# EAGLE design RFNODE (EAGLE 6.5.0)
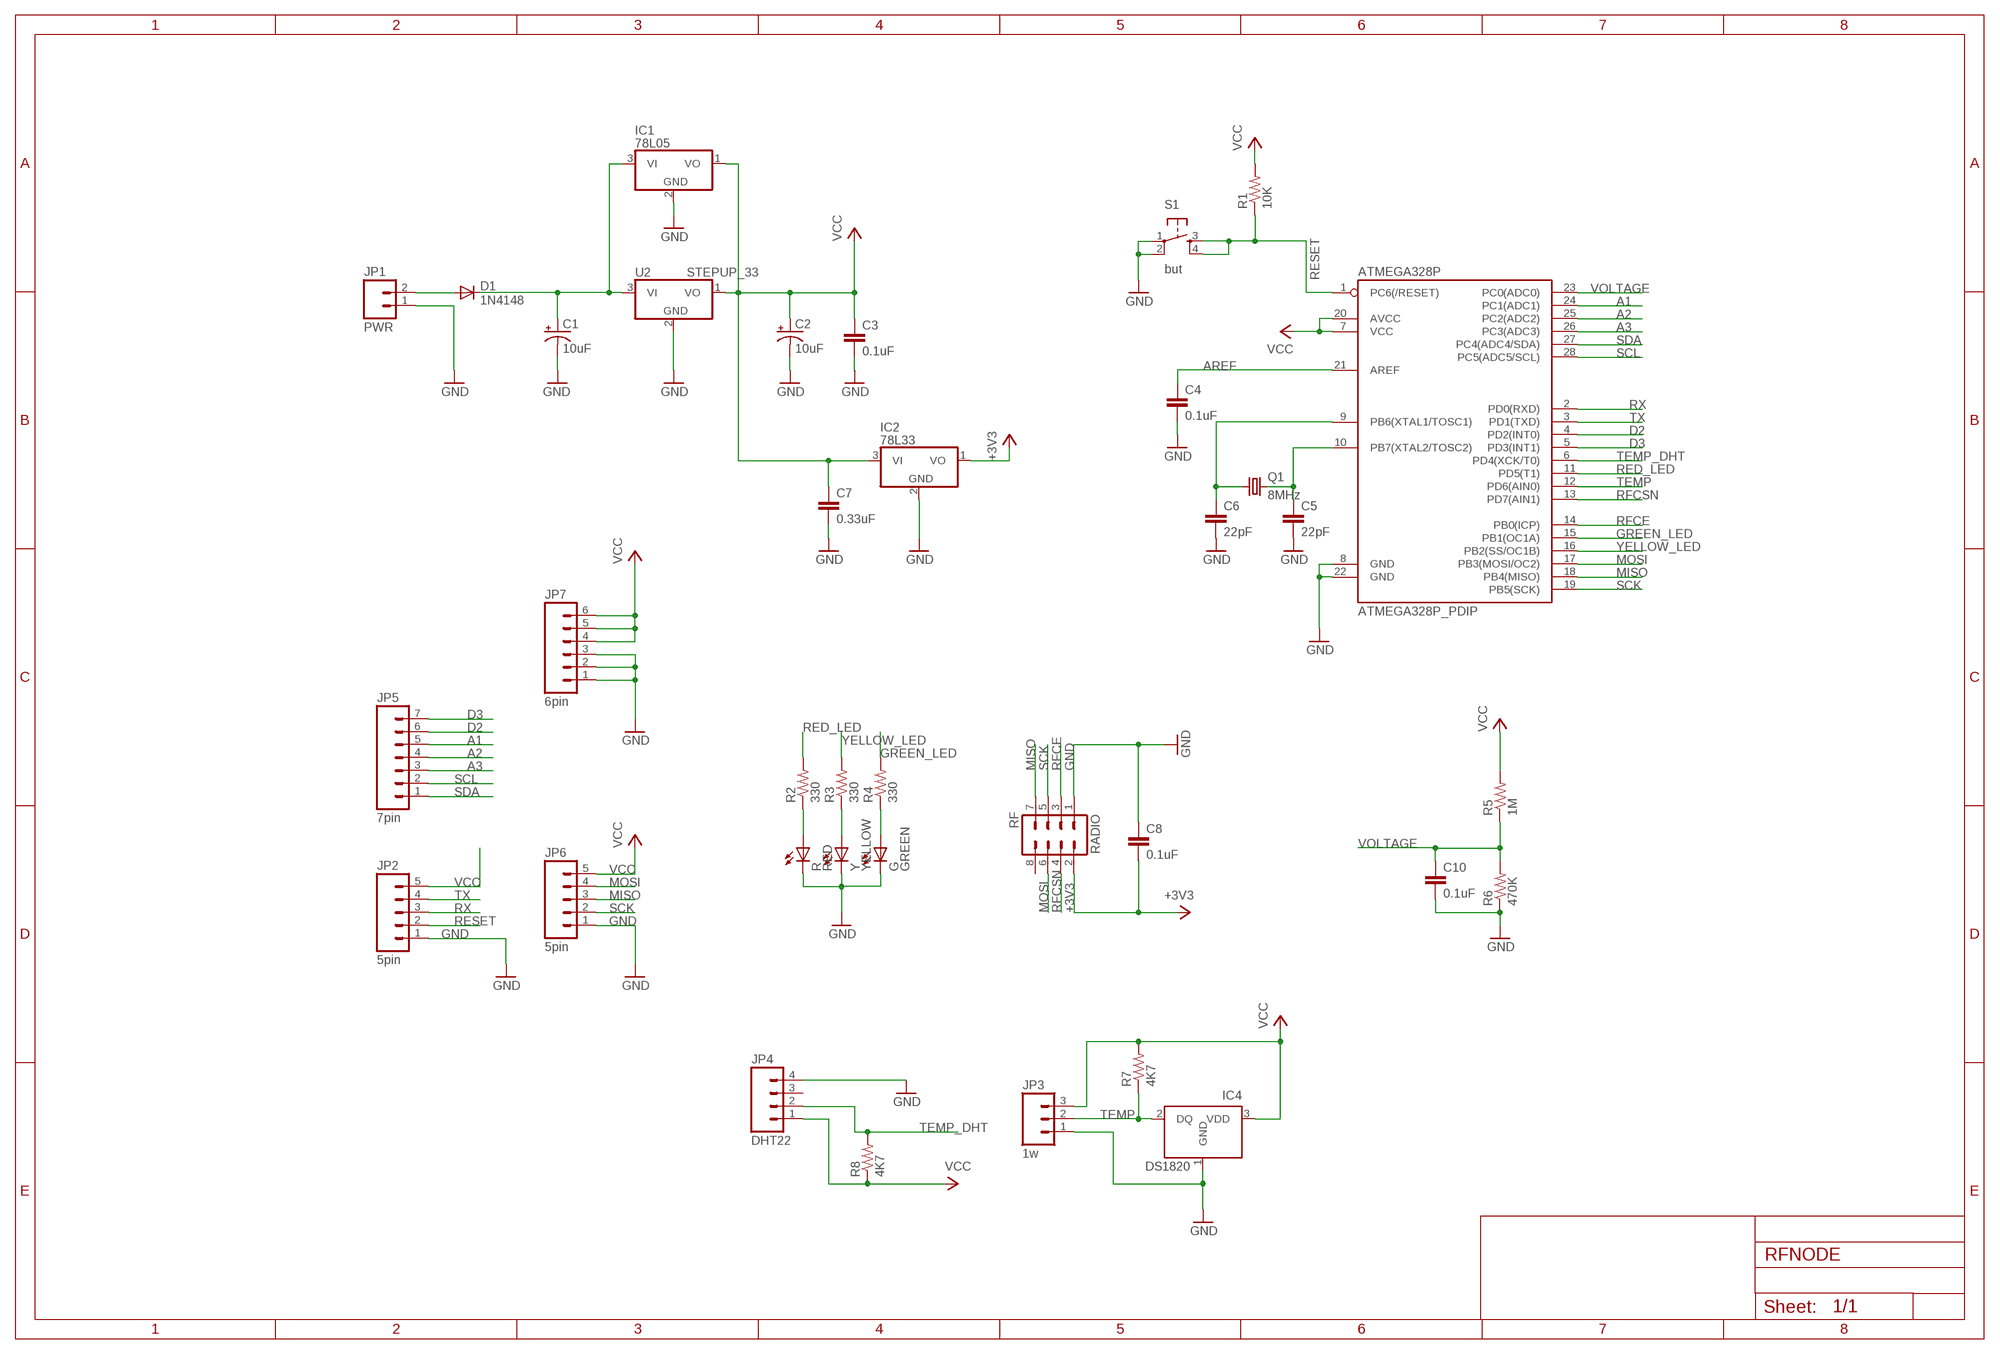
[diagram p0: schematic, sheet 1]

## Parts
ATMEGA328P  ATMEGA328P_PDIP  [DIL28-3]
C1  10uF  CPOL-USE2-4  [E2-4]
C2  10uF  CPOL-USE2-4  [E2-4]
C3  0.1uF  C-EUC1206  [C1206]
C4  0.1uF  C-EUC1206  [C1206]
C5  22pF  C-EUC1206  [C1206]
C6  22pF  C-EUC1206  [C1206]
C7  0.33uF  C-EUC1206  [C1206]
C8  0.1uF  C-EUC1206  [C1206]
C10  0.1uF  C-EUC1206  [C1206]
D1  1N4148  DIODE-D-2.5  [D-2.5]
G  GREEN  LED3MM  [LED3MM]
IC1  78L05  78L05Z  [TO92]
IC2  78L33  78L05Z  [TO92]
IC4  DS1820  [TO-92]
JP1  PWR  M02POLAR  [MOLEX-1X2]
JP2  5pin  M05PTH  [1X05]
JP3  1w  M03PTH  [1X03]
JP4  DHT22  M04PTH  [1X04]
JP5  7pin  M07  [1X07]
JP6  5pin  M05PTH  [1X05]
JP7  6pin  M06SIP  [1X06]
Q1  8MHz  CRYSTALHC49S  [HC49/S]
R  RED  LED3MM  [LED3MM]
R1  10K  R-US_R1206  [R1206]
R2  330  R-US_R1206  [R1206]
R3  330  R-US_R1206  [R1206]
R4  330  R-US_R1206  [R1206]
R5  1M  R-US_R1206  [R1206]
R6  470K  R-US_R1206  [R1206]
R7  4K7  R-US_R1206  [R1206]
R8  4K7  R-US_R1206  [R1206]
RADIO  RF  M04X2  [2X4]
S1  but  TAC_SWITCHPTH  [TACTILE-PTH]
U2  STEPUP_33  DC-DC_STEPUP  [1X03]
Y  YELLOW  LED3MM  [LED3MM]

## Nets
+3V3: C8.2 IC2.1(VO) RADIO.2
A1: ATMEGA328P.24(PC1(ADC1)) JP5.5
A2: ATMEGA328P.25(PC2(ADC2)) JP5.4
A3: ATMEGA328P.26(PC3(ADC3)) JP5.3
AREF: ATMEGA328P.21(AREF) C4.1
D2: ATMEGA328P.4(PD2(INT0)) JP5.6
D3: ATMEGA328P.5(PD3(INT1)) JP5.7
GND: ATMEGA328P.8(GND) ATMEGA328P.22(GND) C1.- C2.- C3.2 C4.2 C5.2 C6.2 C7.2 C8.1 C10.2 G.K(C) IC1.2(GND) IC2.2(GND) IC4.1(GND) JP1.1 JP2.1 JP3.1 JP4.4 JP6.1 JP7.1 JP7.2 JP7.3 R6.1 R.K(C) RADIO.1 S1.1 S1.2 U2.2(GND) Y.K(C)
GREEN_LED: ATMEGA328P.15(PB1(OC1A)) R4.2
MISO: ATMEGA328P.18(PB4(MISO)) JP6.4 RADIO.7
MOSI: ATMEGA328P.17(PB3(MOSI/OC2)) JP6.3 RADIO.6
N$6: R2.1 R.A
N$7: R3.1 Y.A
N$8: G.A R4.1
RAW: D1.A JP1.2
RAW_PROT: C1.+ D1.C IC1.3(VI) U2.3(VI)
RED_LED: ATMEGA328P.11(PD5(T1)) R2.2
RESET: ATMEGA328P.1(PC6(/RESET)) JP2.2 R1.1 S1.3 S1.4
RFCE: ATMEGA328P.14(PB0(ICP)) RADIO.3
RFCSN: ATMEGA328P.13(PD7(AIN1)) RADIO.4
RX: ATMEGA328P.2(PD0(RXD)) JP2.3
SCK: ATMEGA328P.19(PB5(SCK)) JP6.2 RADIO.5
SCL: ATMEGA328P.28(PC5(ADC5/SCL)) JP5.1
SDA: ATMEGA328P.27(PC4(ADC4/SDA)) JP5.2
TEMP: ATMEGA328P.12(PD6(AIN0)) IC4.2(DQ) JP3.2 R7.1
TEMP_DHT: ATMEGA328P.6(PD4(XCK/T0)) JP4.2 R8.2
TX: ATMEGA328P.3(PD1(TXD)) JP2.4
VCC: ATMEGA328P.7(VCC) ATMEGA328P.20(AVCC) C2.+ C3.1 C7.1 IC1.1(VO) IC2.3(VI) IC4.3(VDD) JP2.5 JP3.3 JP4.1 JP6.5 JP7.4 JP7.5 JP7.6 R1.2 R5.2 R7.2 R8.1 U2.1(VO)
VOLTAGE: ATMEGA328P.23(PC0(ADC0)) C10.1 R5.1 R6.2
XTAL1: ATMEGA328P.9(PB6(XTAL1/TOSC1)) C6.1 Q1.1
XTAL2: ATMEGA328P.10(PB7(XTAL2/TOSC2)) C5.1 Q1.2
YELLOW_LED: ATMEGA328P.16(PB2(SS/OC1B)) R3.2
Unconnected: JP4.3 RADIO.8

## Library data of the parts
ATMEGA328P = SparkFun-DigitalIC:ATMEGA328P_PDIP: uC used in the Arduino 32kb flash, 1k EEPROM, 2k SRAM This is the through-hole version of this chip.
C1 C2 = rcl:CPOL-US: POLARIZED CAPACITOR, American symbol
C3-C8 C10 = rcl:C-EU: CAPACITOR, European symbol
D1 = diode:DIODE-: DIODE
G R Y = SparkFun-LED:LED: LEDs Standard schematic elements and footprints for 5mm, 3mm, 1206, and 0603 sized LEDs. 5mm - Spark Fun Electronics SKU : COM-00529 (and others)
IC1 IC2 = adafruit:78*: Positive VOLTAGE REGULATOR Added bigger pads to the TO-92 package
IC4 = DS1820:DS1820: DS1820 - 1-Wire Digital Thermometer
JP1 = SparkFun-Connectors:M02: Standard 2-pin 0.1" header. Use with - straight break away headers ( PRT-00116) - right angle break away headers (PRT-00553) - swiss pins (PRT-00743) - machine pins (PRT-00117) - female headers (PRT-00115) Molex polarized connector foot print use with: PRT-08233 with associated crimp pins and housings. 2.54_SCREWTERM for use with PRT-10571. 3.5mm Screw Terminal footprints for PRT-08084 5mm Screw Terminal footprints for use with PRT-08433
JP2 JP6 = SparkFun-Connectors:M05: Header 5 Standard 5-pin 0.1" header. Use with straight break away headers (SKU : PRT-00116), right angle break away headers (PRT-00553), swiss pins (PRT-00743), machine pins (PRT-00117), and female headers (PRT-00115). Molex polarized connector foot print use with SKU : PRT-08230 with associated crimp pins and housings.
JP3 = SparkFun-Connectors:M03: Header 3 Standard 3-pin 0.1" header. Use with straight break away headers (SKU : PRT-00116), right angle break away headers (PRT-00553), swiss pins (PRT-00743), machine pins (PRT-00117), and female headers (PRT-00115). Molex polarized connector foot print use with SKU : PRT-08232 with associated crimp pins and housings.
JP4 = SparkFun-Connectors:M04: Header 4 Standard 4-pin 0.1" header. Use with straight break away headers (SKU : PRT-00116), right angle break away headers (PRT-00553), swiss pins (PRT-00743), machine pins (PRT-00117), and female headers (PRT-00115). Molex polarized connector foot print use with SKU : PRT-08231 with associated crimp pins and housings. 1MM SMD Version SKU: PRT-10208
JP5 = SparkFun-Connectors:M07: Header 7 Standard 7-pin 0.1" header. Use with straight break away headers (SKU : PRT-00116), right angle break away headers (PRT-00553), swiss pins (PRT-00743), machine pins (PRT-00117), and female headers (PRT-00115). NOTES ON THE VARIANTS LOCK and LOCK_LONGPADS... This footprint was designed to help hold the alignment of a through-hole component (i.e. 7-pin header) while soldering it into place. You may notice that each hole has been shifted either up or down by 0.005 of an inch from it's more standard position (which is usually a perfectly straight line). This slight alteration caused the pins (the squares in the middle) to touch the edges of the holes. Because they are alternating, it causes a "brace" to hold the header in place. 0.005 has proven to be the perfect amount of "off-center" position when using our standard breakaway headers. Although looks a little odd when you look at the bare footprint, once you have a header in there, the alteration is very hard to notice. Also, if you push a header all the way into place, it is covered up entirely on the bottom side. This idea of altering the position of holes to aid alignment will be further integrated into the Sparkfun Library for other footprints. It can help hold any component with 3 or more connection pins.
JP7 = SparkFun-Connectors:M06: Header 6 Standard 6-pin 0.1" header. Use with straight break away headers (SKU : PRT-00116), right angle break away headers (PRT-00553), swiss pins (PRT-00743), machine pins (PRT-00117), and female headers (PRT-00115). Molex polarized connector foot print use with SKU : PRT-08094 with associated crimp pins and housings. NOTES ON THE VARIANTS LOCK and LOCK_LONGPADS... This footprint was designed to help hold the alignment of a through-hole component (i.e. 6-pin header) while soldering it into place. You may notice that each hole has been shifted either up or down by 0.005 of an inch from it's more standard position (which is a perfectly straight line). This slight alteration caused the pins (the squares in the middle) to touch the edges of the holes. Because they are alternating, it causes a "brace" to hold the component in place. 0.005 has proven to be the perfect amount of "off-center" position when using our standard breakaway headers. Although looks a little odd when you look at the bare footprint, once you have a header in there, the alteration is very hard to notice. Also,if you push a header all the way into place, it is covered up entirely on the bottom side. This idea of altering the position of holes to aid alignment will be further integrated into the Sparkfun Library for other footprints. It can help hold any component with 3 or more connection pins.
Q1 = crystal:CRYSTAL: CRYSTAL; OC_FARNELL: 1667008; OC_NEWARK: unknown
R1-R8 = rcl:R-US_: RESISTOR, American symbol
RADIO = SparkFun-Connectors:M04X2: .1" header, two rows of four.
S1 = SparkFun-Electromechanical:TAC_SWITCH: Momentary Switch Button commonly used for reset or general input. Spark Fun Electronics SKU : COM-00097 SMT- SWCH-08247
U2 = az:DC-DC_STEPUP: DC-DC

## Board
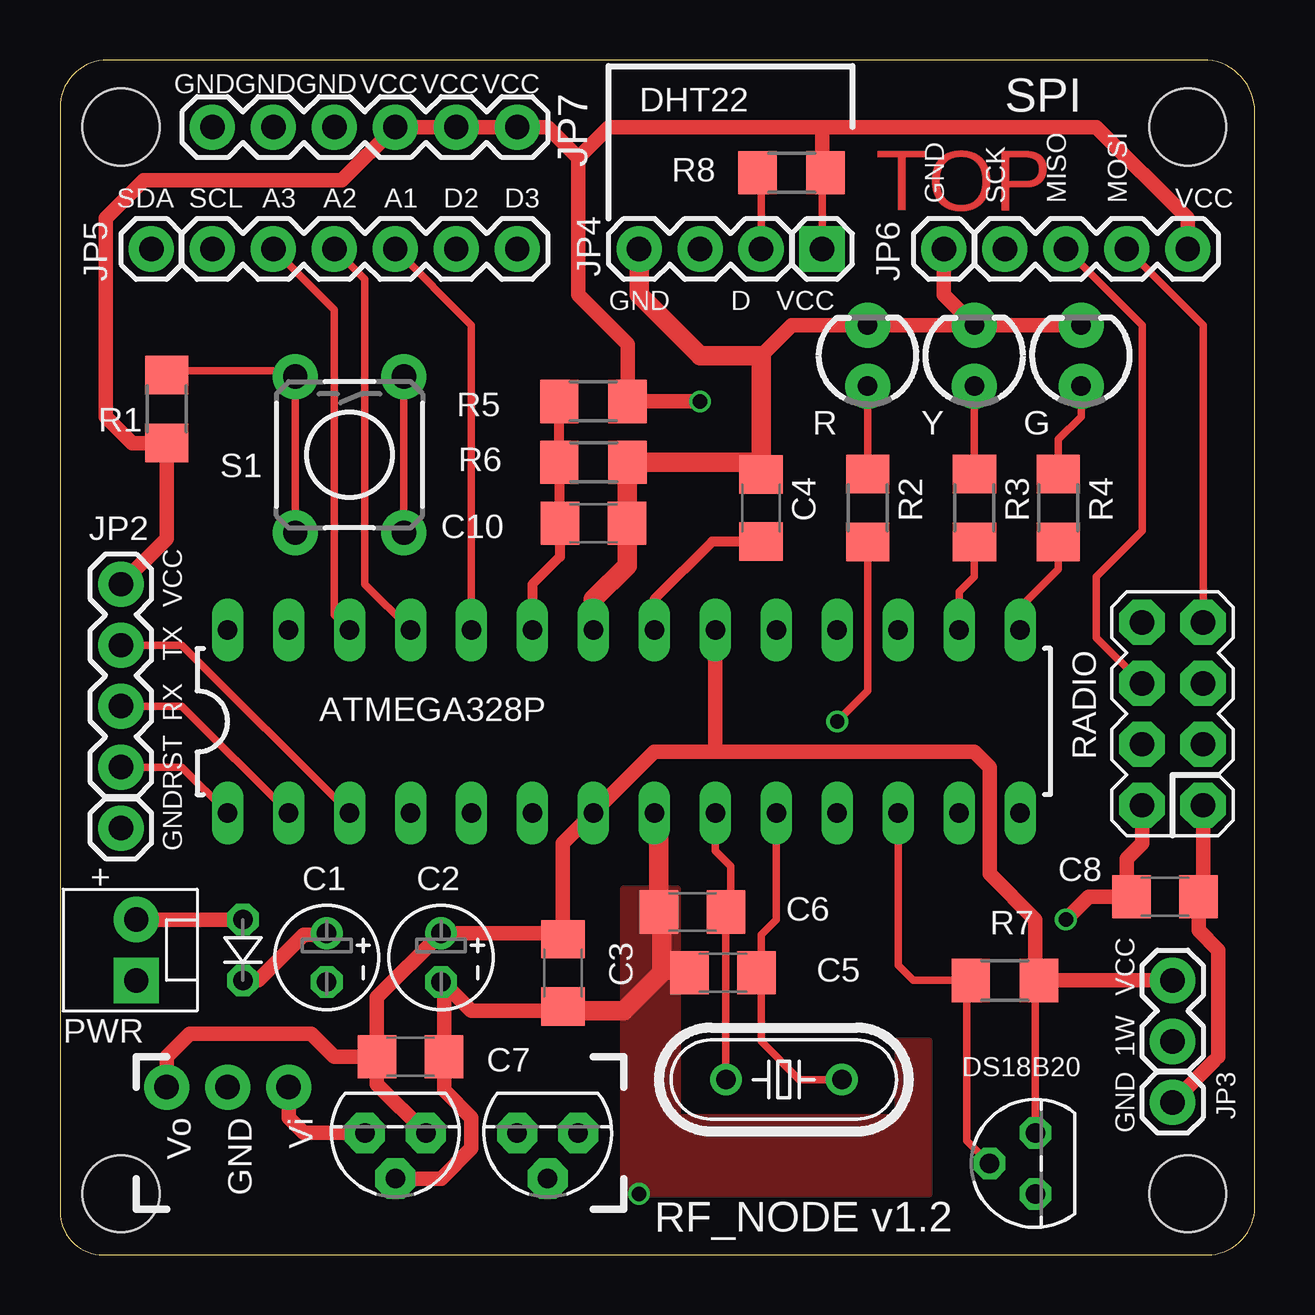
[diagram p1: board, top side]
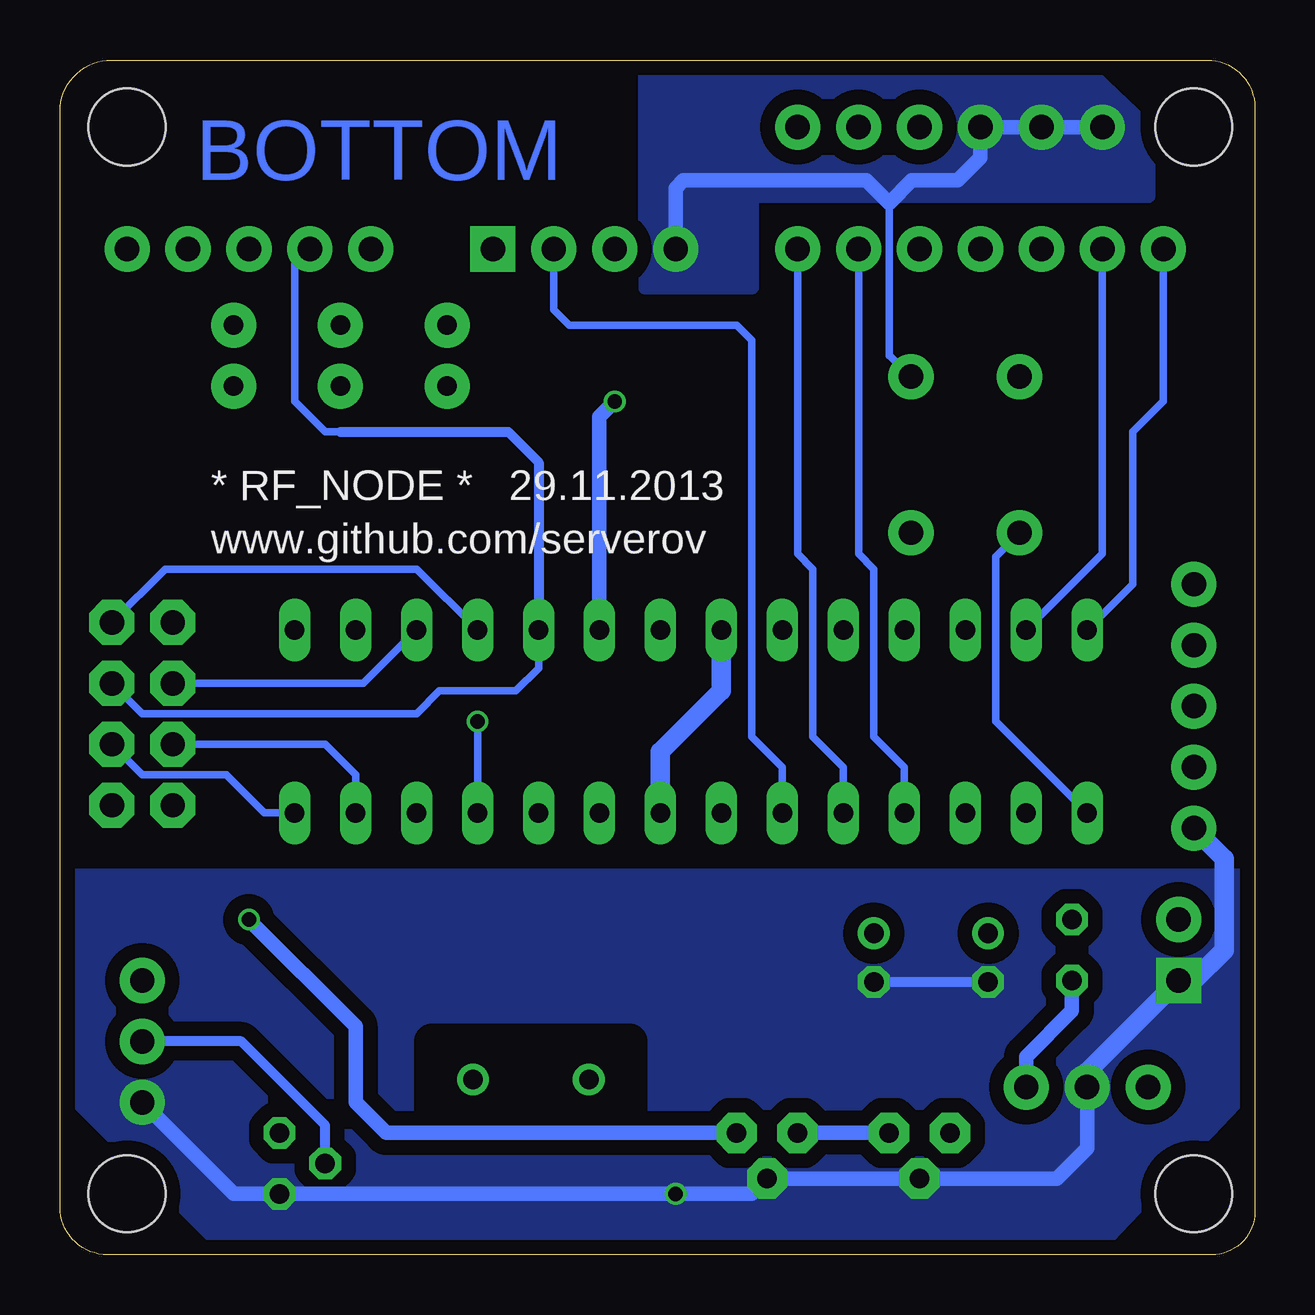
[diagram p2: board, bottom side, seen from below]

Size 49.78 x 49.78 mm. Coordinates in mm from the lower left corner, seen from the top.
Outline: 0,47.8 0,1.8 arc90 1.8,0 47.8,0 arc90 49.78,1.98 49.78,47.63 arc90 47.63,49.78 1.98,49.78 arc90 0,47.8
Copper layers (1*16): Top 0.035mm / dielectric 1.5mm / Bottom 0.035mm
Design rules "ITEADstudio_DRC": minimum track width 6mil, minimum drill 12mil, track to track 6mil, track to pad 6mil, pad to pad 6mil, via to via 6mil, smd to smd 0mil, copper to edge 10mil, drill to drill 10mil, minimum pad ring 10mil, minimum via ring 6mil, stop-mask expansion 2mil, vias tented up to drill 100mil, thermal gap 10mil
Holes 3.2 mm at 2.54,2.54 46.99,2.54 2.54,46.99 46.99,46.99
bRestrict: area 26,5.7 to 34.3,8.9; area 44.1,0 to 49.8,5.7; area -0.3,0 to 5.4,6; area 0,44.1 to 6,49.8

### Footprints (pad centres in the part's own frame; a part is rotated, then mirrored left to right if it is on the bottom)
DIL28-3 = drill 0.813 long: 1 -16.51,-3.81; 2 -13.97,-3.81; 3 -11.43,-3.81; 4 -8.89,-3.81; 5 -6.35,-3.81; 6 -3.81,-3.81; 7 -1.27,-3.81; 8 1.27,-3.81; 9 3.81,-3.81; 10 6.35,-3.81; 11 8.89,-3.81; 12 11.43,-3.81; 13 13.97,-3.81; 14 16.51,-3.81; 15 16.51,3.81; 16 13.97,3.81; 17 11.43,3.81; 18 8.89,3.81; 19 6.35,3.81; 20 3.81,3.81; 21 1.27,3.81; 22 -1.27,3.81; 23 -3.81,3.81; 24 -6.35,3.81; 25 -8.89,3.81; 26 -11.43,3.81; 27 -13.97,3.81; 28 -16.51,3.81
E2-4 = drill 0.813 pad 1.27: + -1.016,0 | drill 0.813 pad 1.27 octagon: - 1.016,0
C1206 = smd 1.6 x 1.8: 1 -1.4,0; 2 1.4,0
D-2.5 = drill 0.813 octagon: A 1.27,0; C -1.27,0
LED3MM = drill 0.813 pad 1.88: A -1.27,0; K 1.27,0
TO92 = drill 0.813 pad 1.676 octagon: 1 -1.27,0; 2 0,1.905; 3 1.27,0
TO-92 = drill 0.813 pad 1.27 octagon: 1 -1.27,0; 2 0,1.905; 3 1.27,0
MOLEX-1X2 = drill 1.016 pad 1.88 square: 1 0,0 | drill 1.016 pad 1.88: 2 2.54,0
1X05 = drill 1.016 pad 1.88: 1 0,0; 2 2.54,0; 3 5.08,0; 4 7.62,0; 5 10.16,0
1X03 = drill 1.016 pad 1.88: 1 0,0; 2 2.54,0; 3 5.08,0
1X04 = drill 1.016 pad 1.88 square: 1 0,0 | drill 1.016 pad 1.88: 2 2.54,0; 3 5.08,0; 4 7.62,0
1X07 = drill 1.016 pad 1.88: 1 0,0; 2 2.54,0; 3 5.08,0; 4 7.62,0; 5 10.16,0; 6 12.7,0; 7 15.24,0
1X06 = drill 1.016 pad 1.88: 1 0,0; 2 2.54,0; 3 5.08,0; 4 7.62,0; 5 10.16,0; 6 12.7,0
HC49/S = drill 0.813: 1 -2.413,0; 2 2.413,0
R1206 = smd 1.6 x 1.803: 1 -1.422,0; 2 1.422,0
2X4 = drill 1.016 pad 1.88 octagon: 1 -3.81,-1.27; 2 -3.81,1.27; 3 -1.27,-1.27; 4 -1.27,1.27; 5 1.27,-1.27; 6 1.27,1.27; 7 3.81,-1.27; 8 3.81,1.27
TACTILE-PTH = drill 1.016 pad 1.88: 1 -3.251,2.261; 2 3.251,2.261; 3 -3.251,-2.261; 4 3.251,-2.261

### Placement (x,y rotation side)
ATMEGA328P  23.5,22.23 0 top
C1  11.11,12.38 270 top
C2  15.88,12.38 270 top
C3  20.95,11.75 270 top
C4  29.21,31.11 90 top
C5  27.62,11.75 180 top
C6  26.35,14.29 180 top
C7  14.61,8.26 0 top
C8  46.04,14.92 180 top
C10  22.23,30.48 0 top
D1  7.62,12.7 90 top
G  42.55,37.47 90 top
IC1  13.97,5.08 180 top
IC2  20.32,5.08 180 top
IC4  40.64,3.81 90 top
JP1  3.17,11.43 90 top
JP2  2.54,17.78 90 top
JP3  46.35,6.35 90 top
JP4  31.75,41.91 180 top
JP5  3.81,41.91 0 top
JP6  36.83,41.91 0 top
JP7  6.35,46.99 0 top
Q1  30.16,7.3 0 top
R  33.66,37.47 90 top
R1  4.45,35.24 270 top
R2  33.66,31.11 270 top
R3  38.1,31.11 270 top
R4  41.59,31.11 270 top
R5  22.23,35.56 0 top
R6  22.23,33.02 180 top
R7  39.37,11.43 0 top
R8  30.48,45.09 180 top
RADIO  46.35,22.54 90 top
S1  12.06,33.34 270 top
U2  4.45,6.99 0 top
Y  38.1,37.47 90 top

### Tracks (layer width: path | path; a pad name or v marks a point on that pad's centre or on a via)
+3V3  (via drill 0.6)
  Top 0.305: 44.45,15.11 C8.2
  Top 0.61: v41.91,13.97 42.86,14.92 C8.2 | 44.45,15.11 44.45,16.51 45.09,17.14 RADIO.2
  Bottom 0.61: v41.91,13.97 37.47,9.53 37.47,6.35 36.2,5.08 IC2.1
A1
  Top 0.305: JP5.5 17.14,38.73 ATMEGA328P.24
A2
  Top 0.305: ATMEGA328P.25 12.7,27.94 12.7,39.37 12.7,40.01 12.7,40.64 JP5.4
A3
  Top 0.305: JP5.3 11.43,39.37 11.43,26.67 ATMEGA328P.26
AREF
  Top 0.406: C4.1 27.18,29.71 24.77,27.3 ATMEGA328P.21
D2
  Bottom 0.305: JP5.6 16.51,29.21 15.88,28.57 15.88,21.59 14.61,20.32 ATMEGA328P.4
D3
  Bottom 0.305: JP5.7 19.05,29.21 18.41,28.57 18.41,21.59 17.14,20.32 ATMEGA328P.5
GND  (via drill 0.6)
  Top 0.305: S1.1 S1.2 | C6.2 25.08,14.16 | C3.2 21.14,10.16 | 47.62,15.11 C8.1 | 48.26,8.26 48.07,8.07
  Top 0.406: 23.62,33 R6.1 | 15.94,11.37 C2.- 16,11.24 | 20.77,10.16 C3.2 | C4.2 29.21,33.02
  Top 0.61: ATMEGA328P.8 24.95,18.23 | 25.08,11.75 C5.2 | IC1.2 15.88,3.17 17.14,4.45 17.14,5.71 16,6.86 C7.2 16,11.24 | 15.94,11.37 17.14,10.16 20.77,10.16 | 22.23,27.3 ATMEGA328P.22 | 29.21,37.47 30.48,38.73 R.K Y.K | Y.K G.K | JP6.1 36.83,40.01 Y.K | C8.1 47.44,13.52 48.26,12.7 48.26,8.26 | 48.07,8.07 JP3.1 | 47.62,15.11 RADIO.1
  Top 0.813: 24.95,18.23 C6.2 | 25.08,14.16 25.08,11.75 23.5,10.16 21.14,10.16 | 23.62,33 C10.2 23.62,28.7 22.23,27.3 | JP4.4 24.13,40.01 26.67,37.47 29.21,37.47 29.21,33.02 R6.1
  Bottom 0.305: S1.1 15.2,37.47 15.24,37.47 15.24,43.81
  Bottom 0.406: C1.- C2.- | U2.2 6.99,7.62
  Bottom 0.61: U2.2 6.99,4.45 8.26,3.17 IC1.2 IC2.2 20.95,2.54 v24.13,2.54 IC4.1 42.55,2.54 JP3.1 | JP4.4 24.13,44.45 23.81,44.77 16.19,44.77 15.24,43.81 14.29,44.77 12.38,44.77 11.43,45.72 JP7.3 JP7.2 JP7.1
  Bottom 0.813: JP2.1 1.27,16.51 1.27,12.7 2.54,11.43 JP1.1 6.99,7.62 | ATMEGA328P.8 24.77,20.95 22.23,23.5 ATMEGA328P.22
  pour Top (rank 6, no thermals): 25.72,15.24 23.5,15.24 23.5,2.54 36.2,2.54 36.2,8.89 34.92,8.89 34.92,5.71 25.72,5.71
  pour Bottom (isolate 0.61, rank 6, no thermals): -0.64,15.88 50.16,15.88 50.16,0 -0.64,0
  pour Bottom (isolate 0.61, rank 6, no thermals): 4.45,50.16 25.4,50.16 25.4,40.32 20.95,40.32 20.95,44.13 4.45,44.13
GREEN_LED
  Top 0.305: ATMEGA328P.15 40.01,26.99 41.59,28.57 R4.2
MISO
  Top 0.305: JP6.4 47.62,38.73 RADIO.7
  Bottom 0.305: ATMEGA328P.18 34.92,28.57 45.4,28.57 RADIO.7
MOSI
  Top 0.305: JP6.3 45.09,38.73 45.09,30.16 43.18,28.26 43.18,25.72 RADIO.6
  Bottom 0.305: RADIO.6 37.15,23.81 ATMEGA328P.17
N$6
  Top 0.305: R.A R2.1
N$7
  Top 0.305: Y.A R3.1
N$8
  Top 0.305: G.A 42.55,34.92 41.59,33.97 R4.1
RAW
  Top 0.61: JP1.2 D1.A
RAW_PROT
  Top 0.406: D1.C 8.26,11.43 | 11.05,13.34 C1.+
  Top 0.61: U2.3 9.53,5.71 10.16,5.08 IC1.3 | 8.26,11.43 10.16,13.34 11.05,13.34
  Bottom 0.61: D1.C 7.62,10.16 9.53,8.26 U2.3
RED_LED  (via drill 0.6)
  Top 0.305: R2.2 33.66,24.13 33.66,23.5 v32.38,22.23
  Bottom 0.305: v32.38,22.23 ATMEGA328P.11
RESET
  Top 0.305: JP2.2 5.08,20.32 ATMEGA328P.1 | R1.1 4.61,36.83 9.53,36.83 9.77,36.59 S1.3 S1.4
  Bottom 0.305: S1.4 10.79,29.1 10.79,22.23 ATMEGA328P.1
RFCE
  Bottom 0.305: ATMEGA328P.14 41.27,18.41 42.86,20 46.35,20 RADIO.3
RFCSN
  Bottom 0.305: ATMEGA328P.13 37.47,20 38.73,21.27 RADIO.4
RX
  Top 0.305: JP2.3 5.08,22.86 ATMEGA328P.2
SCK
  Bottom 0.305: 38.1,34.29 38.73,34.29 40.01,35.56 40.01,41.27 JP6.2 | ATMEGA328P.19 29.84,24.45 30.8,23.5 33.97,23.5 34.92,22.54 46.35,22.54 RADIO.5
  Bottom 0.406: 38.1,34.29 31.11,34.29 29.84,33.02 ATMEGA328P.19
SCL
  Bottom 0.305: JP5.1 3.81,35.56 5.08,34.29 5.08,27.94 ATMEGA328P.28
SDA
  Bottom 0.305: ATMEGA328P.27 6.35,29.21 JP5.2
TEMP
  Top 0.305: R7.1 35.56,11.43 34.92,12.06 ATMEGA328P.12 | IC4.2 37.78,4.76 37.78,11.26
  Top 0.406: 37.78,11.26 R7.1
  Bottom 0.406: IC4.2 38.73,5.4 42.23,8.89 JP3.2
TEMP_DHT
  Top 0.305: JP4.2 29.21,44.93 R8.2
  Bottom 0.305: ATMEGA328P.6 19.68,20.32 20.95,21.59 20.95,38.1 21.59,38.73 28.57,38.73 29.21,39.37 JP4.2
TX
  Top 0.305: JP2.4 5.08,25.4 ATMEGA328P.3
VCC  (via drill 0.6)
  Top 0.305: 31.75,45.24 R8.1 31.75,44.93 JP4.1 | IC4.3 40.64,11.28
  Top 0.406: 20.7,13.4 C3.1 | 40.64,11.58 R7.2 40.64,11.28
  Top 0.61: JP2.5 4.45,29.84 R1.2 3.01,33.82 1.91,34.92 1.91,43.18 3.49,44.77 11.75,44.77 JP7.4 JP7.5 JP7.6 20.32,46.99 21.59,45.72 | C3.1 20.95,17.14 ATMEGA328P.7 24.77,20.95 27.3,20.95 | 27.3,20.95 38.1,20.95 38.73,20.32 38.73,15.88 40.64,13.97 40.64,11.58 | ATMEGA328P.20 27.3,20.95 | 20.7,13.4 C2.+ 13.21,10.73 C7.1 | C7.1 13.21,7.12 IC1.1 | 21.59,45.72 21.59,40.01 23.65,37.95 R5.2 v26.67,35.56 | 21.59,45.72 22.86,46.99 31.75,46.99 | 31.75,46.99 31.75,45.24 | U2.1 4.45,8.26 5.4,9.21 10.48,9.21 11.43,8.26 C7.1 | 31.75,46.99 43.18,46.99 46.99,43.18 JP6.5 | R7.2 JP3.3
  Bottom 0.61: IC1.1 IC2.3 | ATMEGA328P.20 27.3,34.92 v26.67,35.56
VOLTAGE
  Top 0.406: ATMEGA328P.23 19.68,27.94 20.82,29.08 C10.1 20.82,33 R6.2 R5.1
XTAL1
  Top 0.305: Q1.1 C6.1 27.94,14.47 27.94,16.19 27.3,16.83 ATMEGA328P.9
XTAL2
  Top 0.305: Q1.2 30.8,7.3 29.21,8.89 29.21,11.75 C5.1 29.21,11.94 29.21,13.34 29.84,13.97 ATMEGA328P.10
YELLOW_LED
  Top 0.305: ATMEGA328P.16 37.47,27.62 38.1,28.26 R3.2

### Text on the board
Top: TOP
Bottom: BOTTOM
tNames: GND | GND | GND | VCC | VCC | VCC | DHT22 | SPI | SDA | SCL | A3 | A2 | A1 | D2 | D3 | GND | SCK | MISO | MOSI | VCC | GND | D | VCC | VCC | TX | RX | RST | GND | + | VCC | PWR | DS18B20 | 1W | GND | RF_NODE v1.2
bNames: * RF_NODE * 29.11.2013 | www.github.com/serverov